# EAGLE schematic wiring_diagram (EAGLE 9.2.2)
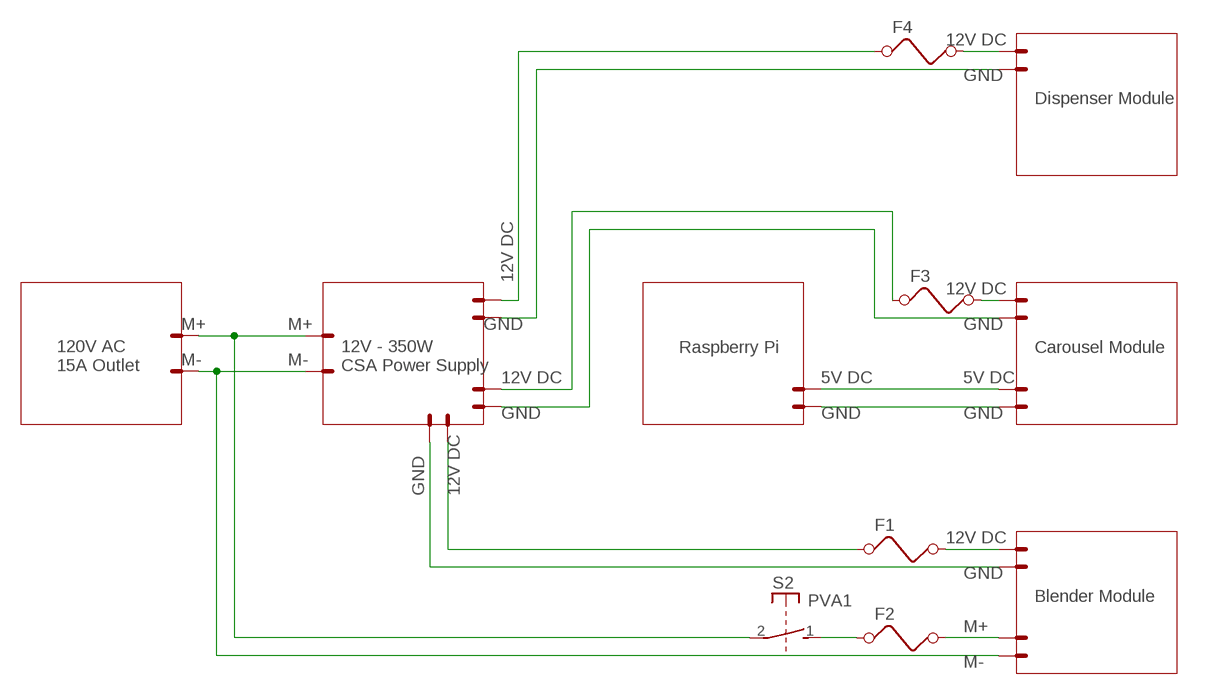
[diagram p0: schematic, sheet 1]

## Parts
F1  FUSE  [FUSE]
F2  FUSE  [FUSE]
F3  FUSE  [FUSE]
F4  FUSE  [FUSE]
S2  PVA1  [PVA1F]
X1  22-23-2021  [22-23-2021]
X2  22-23-2021  [22-23-2021]
X3  22-23-2021  [22-23-2021]
X4  22-23-2021  [22-23-2021]
X5  22-23-2021  [22-23-2021]
X6  22-23-2021  [22-23-2021]
X7  22-23-2021  [22-23-2021]
X8  22-23-2021  [22-23-2021]
X9  22-23-2021  [22-23-2021]
X10  22-23-2021  [22-23-2021]
X11  22-23-2021  [22-23-2021]
X12  22-23-2021  [22-23-2021]
X13  22-23-2021  [22-23-2021]
X14  22-23-2021  [22-23-2021]

## Nets
N$1: X1.1 X2.2 X8.2
N$2: S2.2(1:P)
N$3: F4.1 X3.2
N$4: X3.1 X6.2
N$5: X4.2 X9.1
N$6: X4.1 X10.1
N$7: F3.1 X12.1
N$8: X5.2 X11.1
N$9: F1.1 X13.1
N$10: X7.2 X14.1
N$12: F1.2 X7.1
N$13: F2.2 X8.1
N$14: F3.2 X5.1
N$15: F4.2 X6.1
N$16: F2.1 S2.1(1:S)
N$17: X1.2 X2.1
Unconnected: S2.3(2:S) S2.4(2:P) X9.2 X10.2 X11.2 X12.2 X13.2 X14.2

## Notes on the sheet
- 12V DC
- GND
- Dispenser Module
- 12V DC | 12V DC
- M+ | M+ | GND | GND
- M- | M- | Raspberry Pi | Carousel Module
- 120V AC
  15A Outlet
- 12V - 350W
  CSA Power Supply
- 12V DC | 5V DC | 5V DC
- GND | GND | GND
- GND | 12V DC
- 12V DC
- GND
- Blender Module
- M+
- M-

## Library data of the parts
F1-F4 = special:FUSE: FUSE 5 x 20 mm
S2 = switch-misc:PVA1: ITT SWITCH
X1-X14 = con-molex:22-23-2021: .100" (2.54mm) Center Header - 2 Pin; MF: MOLEX; MPN: 22-23-2021; OC_FARNELL: 1462926; OC_NEWARK: 25C3832